# EAGLE design vca (EAGLE 9.5.2)
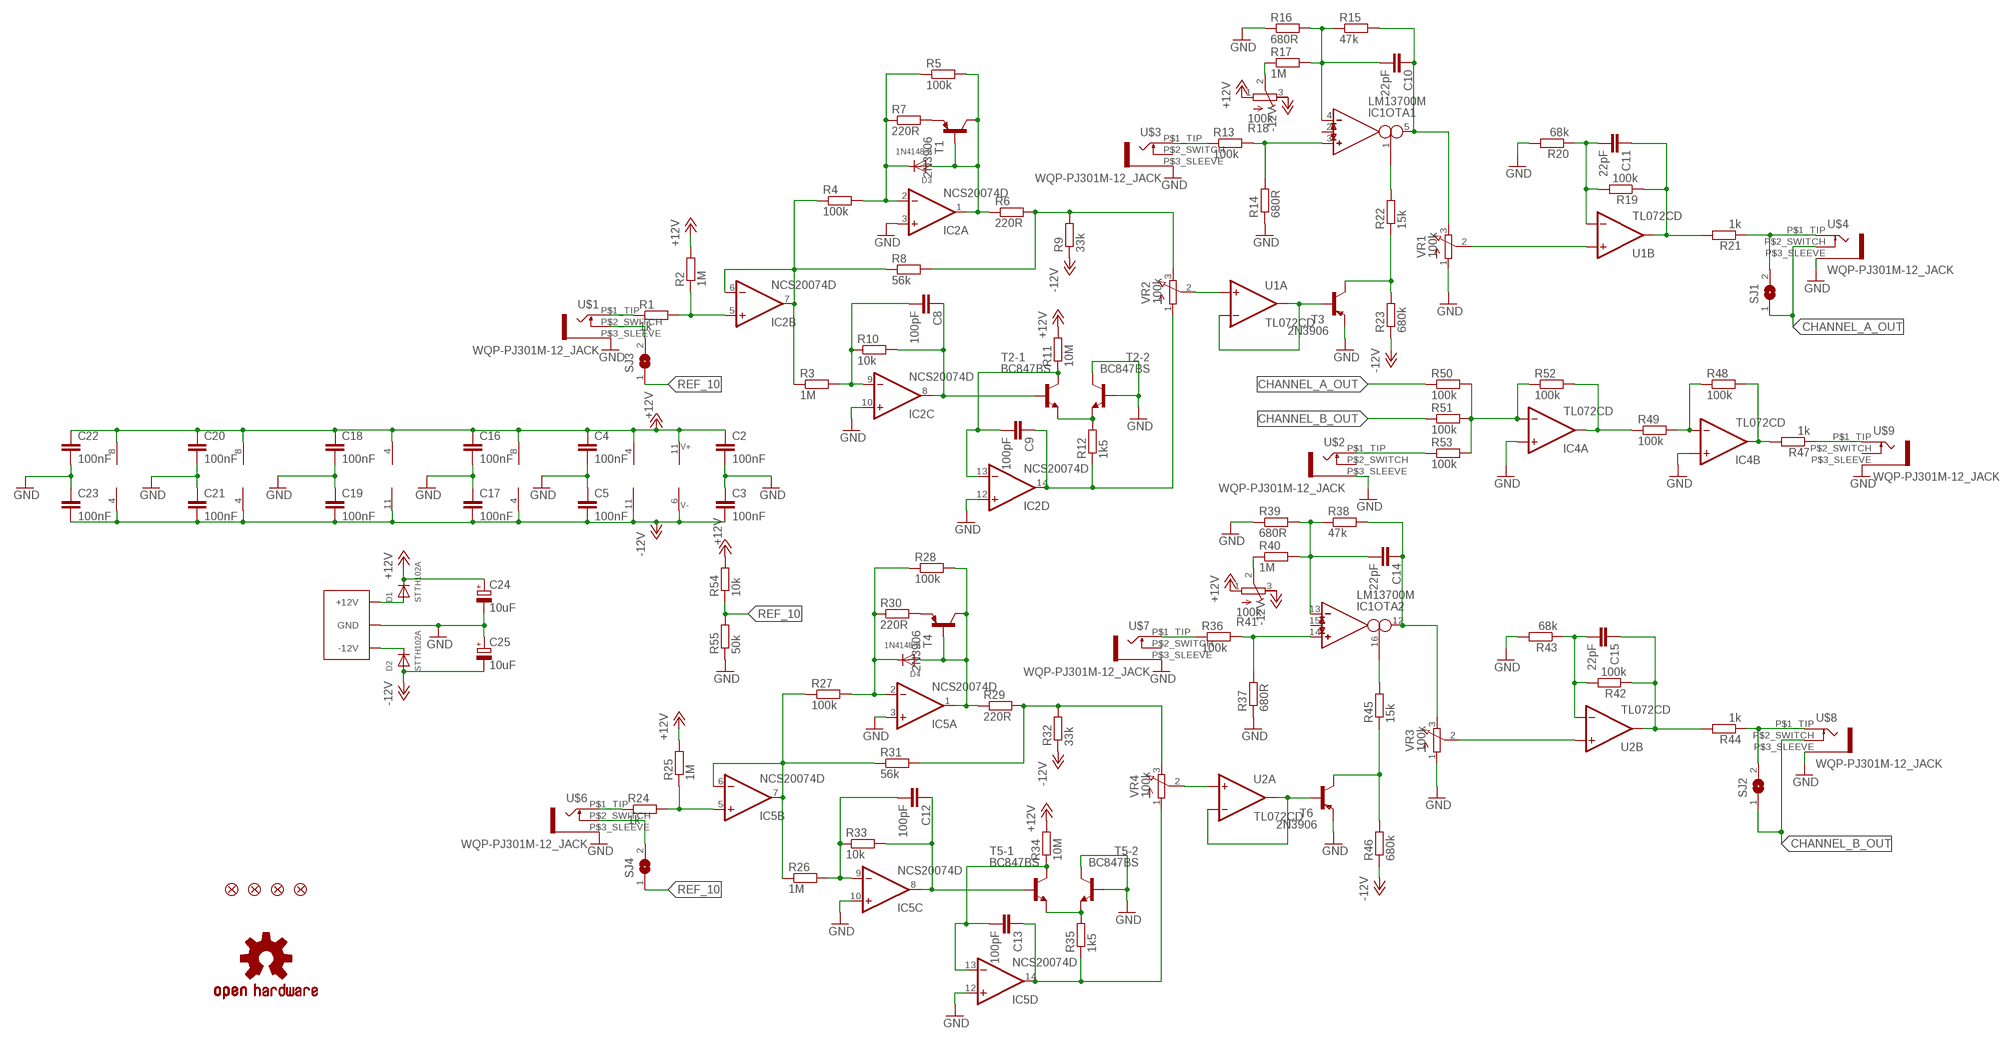
[diagram p0: schematic, sheet 1]

## Parts
C1  EURO_POWER_LOCKFAT-LOCK  [EURO_PWR_HEADER_LOCK]
C2  100nF  C-EUC0402  [C0402]
C3  100nF  C-EUC0402  [C0402]
C4  100nF  C-EUC0402  [C0402]
C5  100nF  C-EUC0402  [C0402]
C8  100pF  C-EUC0402  [C0402]
C9  100pF  C-EUC0402  [C0402]
C10  22pF  C-EUC0402  [C0402]
C11  22pF  C-EUC0402  [C0402]
C12  100pF  C-EUC0402  [C0402]
C13  100pF  C-EUC0402  [C0402]
C14  22pF  C-EUC0402  [C0402]
C15  22pF  C-EUC0402  [C0402]
C16  100nF  C-EUC0402  [C0402]
C17  100nF  C-EUC0402  [C0402]
C18  100nF  C-EUC0402  [C0402]
C19  100nF  C-EUC0402  [C0402]
C20  100nF  C-EUC0402  [C0402]
C21  100nF  C-EUC0402  [C0402]
C22  100nF  C-EUC0402  [C0402]
C23  100nF  C-EUC0402  [C0402]
C24  10uF  CPOL-EUA/3216-18W  [A/3216-18W]
C25  10uF  CPOL-EUA/3216-18W  [A/3216-18W]
D1  STTH102A  DIODESMA  [SMADIODE]
D2  STTH102A  DIODESMA  [SMADIODE]
D3  1N4148-2  DIODESOD-123  [SOD-123]
D4  1N4148-2  DIODESOD-123  [SOD-123]
FD1  FIDUCIAL1X2  [FIDUCIAL-1X2]
FD2  FIDUCIAL1X2  [FIDUCIAL-1X2]
FD3  FIDUCIAL1X2  [FIDUCIAL-1X2]
FD4  FIDUCIAL1X2  [FIDUCIAL-1X2]
IC1  LM13700M  [SO16]
IC2  NCS20074D  [SO14]
IC4  TL072CD  [SOIC8]
IC5  NCS20074D  [SO14]
LOGO1  OSHW-LOGOM  [OSHW-LOGO-M]
R1  1k  R-EU_R0402  [R0402]
R2  1M  R-EU_R0402  [R0402]
R3  1M  R-EU_R0402  [R0402]
R4  100k  R-EU_R0402  [R0402]
R5  100k  R-EU_R0402  [R0402]
R6  220R  R-EU_R0402  [R0402]
R7  220R  R-EU_R0402  [R0402]
R8  56k  R-EU_R0402  [R0402]
R9  33k  R-EU_R0402  [R0402]
R10  10k  R-EU_R0402  [R0402]
R11  10M  R-EU_R0402  [R0402]
R12  1k5  R-EU_R0402  [R0402]
R13  100k  R-EU_R0402  [R0402]
R14  680R  R-EU_R0402  [R0402]
R15  47k  R-EU_R0402  [R0402]
R16  680R  R-EU_R0402  [R0402]
R17  1M  R-EU_R0402  [R0402]
R18  100k  R-TRIMM64W  [RTRIM64W]
R19  100k  R-EU_R0402  [R0402]
R20  68k  R-EU_R0402  [R0402]
R21  1k  R-EU_R0402  [R0402]
R22  15k  R-EU_R0402  [R0402]
R23  680k  R-EU_R0402  [R0402]
R24  1k  R-EU_R0402  [R0402]
R25  1M  R-EU_R0402  [R0402]
R26  1M  R-EU_R0402  [R0402]
R27  100k  R-EU_R0402  [R0402]
R28  100k  R-EU_R0402  [R0402]
R29  220R  R-EU_R0402  [R0402]
R30  220R  R-EU_R0402  [R0402]
R31  56k  R-EU_R0402  [R0402]
R32  33k  R-EU_R0402  [R0402]
R33  10k  R-EU_R0402  [R0402]
R34  10M  R-EU_R0402  [R0402]
R35  1k5  R-EU_R0402  [R0402]
R36  100k  R-EU_R0402  [R0402]
R37  680R  R-EU_R0402  [R0402]
R38  47k  R-EU_R0402  [R0402]
R39  680R  R-EU_R0402  [R0402]
R40  1M  R-EU_R0402  [R0402]
R41  100k  R-TRIMM64W  [RTRIM64W]
R42  100k  R-EU_R0402  [R0402]
R43  68k  R-EU_R0402  [R0402]
R44  1k  R-EU_R0402  [R0402]
R45  15k  R-EU_R0402  [R0402]
R46  680k  R-EU_R0402  [R0402]
R47  1k  R-EU_R0402  [R0402]
R48  100k  R-EU_R0402  [R0402]
R49  100k  R-EU_R0402  [R0402]
R50  100k  R-EU_R0402  [R0402]
R51  100k  R-EU_R0402  [R0402]
R52  100k  R-EU_R0402  [R0402]
R53  100k  R-EU_R0402  [R0402]
R54  10k  R-EU_R0402  [R0402]
R55  50k  R-EU_R0402  [R0402]
SJ1  SJ  [SJ]
SJ2  SJ  [SJ]
SJ3  SJ  [SJ]
SJ4  SJ  [SJ]
T1  2N3906  MMBT3906LT1-PNP-SOT23-BEC  [SOT23-BEC]
T2  BC847BS  [SOT363]
T3  2N3906  MMBT3906LT1-PNP-SOT23-BEC  [SOT23-BEC]
T4  2N3906  MMBT3906LT1-PNP-SOT23-BEC  [SOT23-BEC]
T5  BC847BS  [SOT363]
T6  2N3906  MMBT3906LT1-PNP-SOT23-BEC  [SOT23-BEC]
U1  TL072CD  [SOIC8]
U2  TL072CD  [SOIC8]
U$1  WQP-PJ301M-12_JACK  [WQP-PJ301M-12_JACK]
U$2  WQP-PJ301M-12_JACK  [WQP-PJ301M-12_JACK]
U$3  WQP-PJ301M-12_JACK  [WQP-PJ301M-12_JACK]
U$4  WQP-PJ301M-12_JACK  [WQP-PJ301M-12_JACK]
U$6  WQP-PJ301M-12_JACK  [WQP-PJ301M-12_JACK]
U$7  WQP-PJ301M-12_JACK  [WQP-PJ301M-12_JACK]
U$8  WQP-PJ301M-12_JACK  [WQP-PJ301M-12_JACK]
U$9  WQP-PJ301M-12_JACK  [WQP-PJ301M-12_JACK]
VR1  100k  9MM_SNAP-IN_POT_  [9MM_SNAP-IN_POT]
VR2  100k  9MM_SNAP-IN_POT_  [9MM_SNAP-IN_POT]
VR3  100k  9MM_SNAP-IN_POT_  [9MM_SNAP-IN_POT]
VR4  100k  9MM_SNAP-IN_POT_  [9MM_SNAP-IN_POT]

## Nets
+12V [power]: C2.1 C4.1 C16.1 C18.1 C20.1 C22.1 C24.+ D1.C IC1.11(SUPPLY:V+) IC2.4(P:V+) IC4.8(P:V+) IC5.4(P:V+) R2.2 R11.2 R18.1(A) R25.2 R34.2 R41.1(A) R54.2 U1.8(P:V+) U2.8(P:V+)
-12V [power]: C3.2 C5.2 C17.2 C19.2 C21.2 C23.2 C25.- D2.A IC1.6(SUPPLY:V-) IC2.11(P:V-) IC4.4(P:V-) IC5.11(P:V-) R9.1 R18.3(E) R23.1 R32.1 R41.3(E) R46.1 U1.4(P:V-) U2.4(P:V-)
CHANNEL_A: R21.1 SJ1.2 U$4.P$1_TIP
CHANNEL_A_OUT: R50.1 SJ1.1 U$4.P$2_SWITCH
CHANNEL_B: R44.1 SJ2.2 U$8.P$1_TIP
CHANNEL_B_OUT: R51.1 SJ2.1 U$8.P$2_SWITCH
GND [power]: C1.GND1(GND) C1.GND2(GND) C1.GND3(GND) C1.GND4(GND) C1.GND5(GND) C1.GND6(GND) C2.2 C3.1 C4.2 C5.1 C16.2 C17.1 C18.2 C19.1 C20.2 C21.1 C22.2 C23.1 C24.- C25.+ IC2.3(A:+IN) IC2.10(C:+IN) IC2.12(D:+IN) IC4.3(A:+IN) IC4.5(B:+IN) IC5.3(A:+IN) IC5.10(C:+IN) IC5.12(D:+IN) R14.1 R16.1 R20.2 R37.1 R39.1 R43.2 R55.1 T2.3(-2:C) T2.5(-2:B) T3.E T5.3(-2:C) T5.5(-2:B) T6.E U$1.P$3_SLEEVE U$2.P$3_SLEEVE U$3.P$3_SLEEVE U$4.P$3_SLEEVE U$6.P$3_SLEEVE U$7.P$3_SLEEVE U$8.P$3_SLEEVE U$9.P$3_SLEEVE VR1.1(A) VR3.1(A)
N$1: IC2.5(B:+IN) R1.2 R2.1
N$2: C8.2 IC2.9(C:-IN) R3.2 R10.1
N$3: IC2.6(B:-IN) IC2.7(B:OUT) R3.1 R4.1 R8.1
N$4: R1.1 U$1.P$1_TIP
N$5: C8.1 IC2.8(C:OUT) R10.2 T2.2(-1:B)
N$6: C9.2 IC2.13(D:-IN) R11.1 T2.6(-1:C)
N$7: R6.2 R8.2 R9.2 VR2.3(E)
N$8: R7.2 T1.E
N$9: D3.A IC2.1(A:OUT) R5.2 R6.1 T1.B T1.C
N$10: C10.2 IC1.4(OTA1:IN_N) R15.1 R16.2 R17.2
N$11: D3.C IC2.2(A:-IN) R4.2 R5.1 R7.1
N$12: R12.2 T2.1(-1:E) T2.4(-2:E)
N$13: C9.1 IC2.14(D:OUT) R12.1 VR2.1(A)
N$14: R13.1 U$3.P$1_TIP
N$15: IC1.3(OTA1:IN_P) R13.2 R14.2
N$16: R47.1 U$9.P$1_TIP
N$17: C10.1 IC1.5(OTA1:OUT) R15.2 VR1.3(E)
N$18: R17.1 R18.2(S)
N$19: U1.5(B:+IN) VR1.2(S)
N$20: C11.2 R19.2 R20.1 U1.6(B:-IN)
N$21: IC5.5(B:+IN) R24.2 R25.1
N$22: C11.1 R19.1 R21.2 U1.7(B:OUT)
N$23: T3.B U1.1(A:OUT) U1.2(A:-IN)
N$24: U1.3(A:+IN) VR2.2(S)
N$25: IC1.1(OTA1:I_BIAS) R22.2
N$26: R22.1 R23.2 T3.C
N$27: C12.2 IC5.9(C:-IN) R26.2 R33.1
N$28: IC5.6(B:-IN) IC5.7(B:OUT) R26.1 R27.1 R31.1
N$29: R24.1 U$6.P$1_TIP
N$30: R29.2 R31.2 R32.2 VR4.3(E)
N$31: R30.2 T4.E
N$32: D4.A IC5.1(A:OUT) R28.2 R29.1 T4.B T4.C
N$33: D4.C IC5.2(A:-IN) R27.2 R28.1 R30.1
N$34: C12.1 IC5.8(C:OUT) R33.2 T5.2(-1:B)
N$35: R35.2 T5.1(-1:E) T5.4(-2:E)
N$36: C13.2 IC5.13(D:-IN) R34.1 T5.6(-1:C)
N$37: C13.1 IC5.14(D:OUT) R35.1 VR4.1(A)
N$38: R36.1 U$7.P$1_TIP
N$39: IC1.14(OTA2:IN_P) R36.2 R37.2
N$40: C14.2 IC1.13(OTA2:IN_N) R38.1 R39.2 R40.2
N$41 [power]: C1.NEG1(-12V) C1.NEG2(-12V) D2.C
N$42 [power]: C1.POS1(+12V) C1.POS2(+12V) D1.A
N$43: C14.1 IC1.12(OTA2:OUT) R38.2 VR3.3(E)
N$44: R40.1 R41.2(S)
N$45: C15.2 R42.2 R43.1 U2.6(B:-IN)
N$46: U2.5(B:+IN) VR3.2(S)
N$47: C15.1 R42.1 R44.2 U2.7(B:OUT)
N$48: IC4.6(B:-IN) R48.1 R49.2
N$49: T6.B U2.1(A:OUT) U2.2(A:-IN)
N$50: U2.3(A:+IN) VR4.2(S)
N$51: IC1.16(OTA2:I_BIAS) R45.2
N$52: R45.1 R46.2 T6.C
N$53: IC4.1(A:OUT) R49.1 R52.2
N$54: IC4.7(B:OUT) R47.2 R48.2
N$55: IC4.2(A:-IN) R50.2 R51.2 R52.1 R53.2
N$56: SJ3.2 U$1.P$2_SWITCH
N$57: R53.1 U$2.P$1_TIP
N$58: SJ4.2 U$6.P$2_SWITCH
REF_10: R54.1 R55.2 SJ3.1 SJ4.1
Unconnected: IC1.2(OTA1:I_DIODE) IC1.7(BUF1:B) IC1.8(BUF1:E) IC1.9(BUF2:E) IC1.10(BUF2:B) IC1.15(OTA2:I_DIODE) U$2.P$2_SWITCH U$3.P$2_SWITCH U$7.P$2_SWITCH U$9.P$2_SWITCH

## Library data of the parts
C1 = jhbruhn-physical:EURO_POWER_LOCK
C2-C5 C8-C23 = jhbruhn-cr:C-EU: CAPACITOR, European symbol; SPICEPREFIX: C
C24 C25 = rcl:CPOL-EU: POLARIZED CAPACITOR, European symbol; SPICEPREFIX: C
D1-D4 = adafruit:DIODE: Diode SMADIODE - SMA Surface Mount Package 20V 1A Schottky Diode Digikey: 641-1014-6-ND DO-1N4148 - Through Hole Small Current Diode SOD-123 20V 1 A (.5mV Vf) Schottky Diode - Digikey: MBRX120TPMSCT-ND SOD-323 10V 570mA (.38mV Vf, 3ns) Schottky Diode - Digikey: ZLLS410CT-ND SOD-523 30V 30mA Schottky Diode (RB751S-40TE61) - Digikey: RB751S-40TE61CT-ND SOT23-R/W - SOT23 Package (R = Solder Paste/Reflow Ovens, W = Hand-Soldering) BAT54Film 40V 300mA - Digikey: 497-7162-1-ND
FD1-FD4 = SparkFun-Aesthetics:FIDUCIAL: Fiducial Alignment Points Point-of-reference for pick-and-place machines and other optical instruments.
IC1 = jhbruhn-ota:LM13700: Dual OTA with buffers
IC2 IC5 = ncs20074:NCS20074: OP AMP
IC4 U1 U2 = jhbruhn-opamp:TL072: Generic Dual Op Amp
LOGO1 = SparkFun-Aesthetics:OSHW-LOGO: Open-Source Hardware (OSHW) Logo This logo indicates the piece of hardware it is found on incorporates a OSHW license and/or adheres to the definition of open source hardware found here: http://freedomdefined.org/OSHW
R1-R17 R19-R40 R42-R55 = jhbruhn-cr:R-EU_: RESISTOR, European symbol; SPICEPREFIX: R
R18 R41 = rcl:R-TRIMM: Trimm resistor; SPICEMODEL: X; SPICEPREFIXL: POT
SJ1-SJ4 = jumper:SJ: SMD solder JUMPER
T1 T3 T4 T6 = transistor-neu-to92:*-PNP-: PNP Transistror
T2 T5 = nxp_60:BC847BS: NPN/NPN general-purpose transistor pair in a very small SOT363 (SC-88) Surface-Mounted Device (SMD) plastic package. AAL Eindhoven MK
U$1-U$4 U$6-U$9 = jhbruhn-physical:WQP-PJ301M-12_JACK
VR1-VR4 = jhbruhn-physical:9MM_SNAP-IN_POT: 9mm vertical snap-in pot, Alpha / Panasonic style

## Net classes
0 default: width 0.254 mm
1 power: width 0.406 mm

## Board
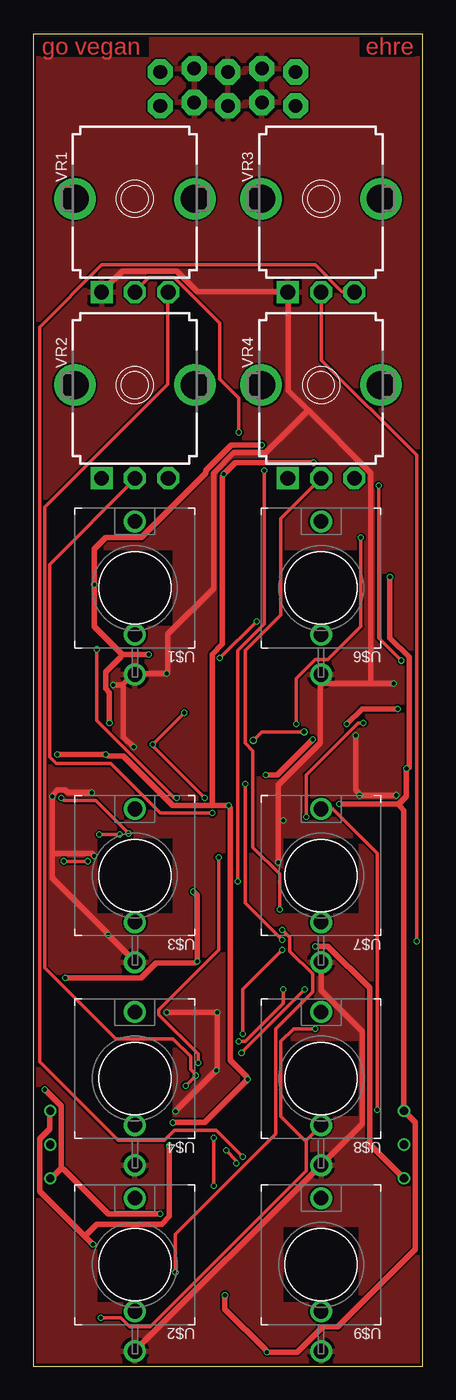
[diagram p1: board, top side]
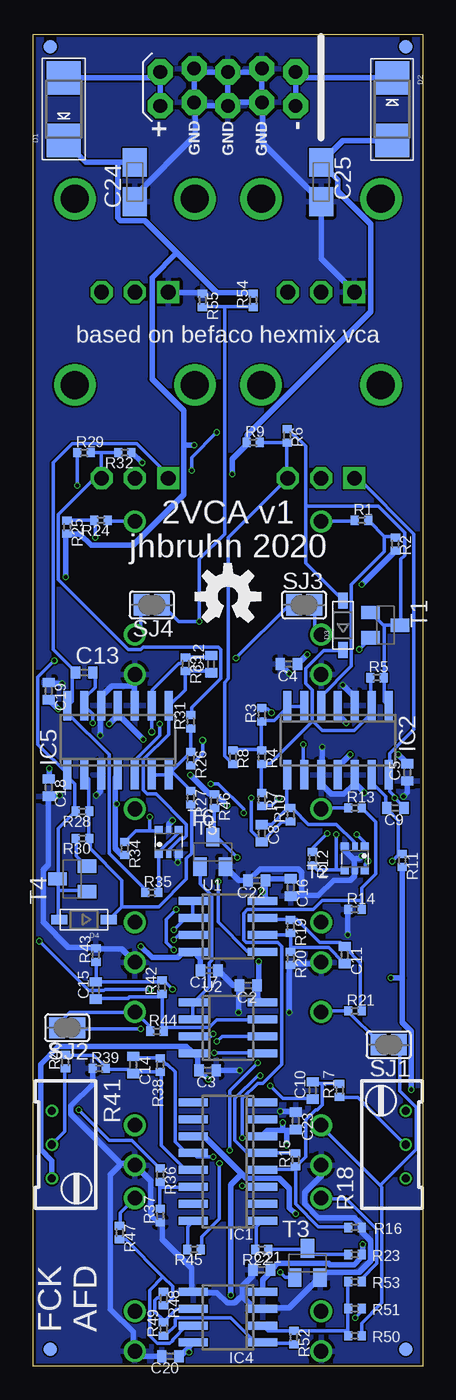
[diagram p2: board, bottom side, seen from below]

Size 29.21 x 100 mm. Coordinates in mm from the lower left corner, seen from the top.
Outline: 0,0 29.21,0 29.21,100 0,100 0,0
Copper layers (1*16): Top 0.035559375mm / dielectric 1.6mm / Bottom 0.035559375mm
Design rules "jlcpcb2layer": minimum track width 5mil, minimum drill 12mil, track to track 5mil, track to pad 5mil, pad to pad 5mil, via to via 5mil, smd to smd 5mil, copper to edge 8mil, drill to drill 6mil, minimum pad ring 5mil, minimum via ring 3mil, stop-mask expansion 2.5mil, vias tented up to drill 0mil, thermal gap 10mil

### Footprints (pad centres in the part's own frame; a part is rotated, then mirrored left to right if it is on the bottom)
EURO_PWR_HEADER_LOCK = drill 1.016 pad 1.88 octagon: GND1 -2.54,1.143; GND2 -2.54,-1.397; GND3 0,1.397; GND4 0,-1.143; GND5 2.54,1.143; GND6 2.54,-1.397; NEG1 -5.08,1.397; NEG2 -5.08,-1.143; POS1 5.08,1.397; POS2 5.08,-1.143
C0402 = smd 0.7 x 0.9: 1 -0.65,0; 2 0.65,0
A/3216-18W = smd 2.15 x 1.8: + 1.475,0; - -1.475,0
SMADIODE = smd 2.54 x 2.54: A 2.349,0; C -2.349,0
SOD-123 = smd 1.2 x 0.7: A 1.85,0; C -1.85,0
FIDUCIAL-1X2 = smd 1 x 1: 1 0,0
SO16 = smd 0.6 x 2.2: 1 -4.445,-2.6; 2 -3.175,-2.6; 3 -1.905,-2.6; 4 -0.635,-2.6; 5 0.635,-2.6; 6 1.905,-2.6; 7 3.175,-2.6; 8 4.445,-2.6; 9 4.445,2.6; 10 3.175,2.6; 11 1.905,2.6; 12 0.635,2.6; 13 -0.635,2.6; 14 -1.905,2.6; 15 -3.175,2.6; 16 -4.445,2.6
SO14 = smd 0.6 x 2.2: 1 -3.81,-2.6; 2 -2.54,-2.6; 3 -1.27,-2.6; 4 0,-2.6; 5 1.27,-2.6; 6 2.54,-2.6; 7 3.81,-2.6; 8 3.81,2.6; 9 2.54,2.6; 10 1.27,2.6; 11 0,2.6; 12 -1.27,2.6; 13 -2.54,2.6; 14 -3.81,2.6
SOIC8 = smd 0.6 x 2.2: 1 -1.905,-2.6; 2 -0.635,-2.6; 3 0.635,-2.6; 4 1.905,-2.6; 5 1.905,2.6; 6 0.635,2.6; 7 -0.635,2.6; 8 -1.905,2.6
R0402 = smd 0.6 x 0.7: 1 -0.5,0; 2 0.5,0
RTRIM64W = drill 0.61: 1 1.27,-2.54; 2 1.27,0; 3 1.27,2.54
SJ = smd 1.168 x 1.6: 1 -0.762,0; 2 0.762,0
SOT23-BEC = smd 1 x 1.4: B -0.95,-1.1; C 0,1.1; E 0.95,-1.1
SOT363 = smd 0.6 x 0.6: 1 -0.75,-0.9; 3 0.75,-0.9; 4 0.75,0.9; 6 -0.75,0.9 | smd 0.4 x 0.6: 2 0,-0.9; 5 0,0.9
WQP-PJ301M-12_JACK = drill 1.1: P$1_TIP 0,5; P$2_SWITCH 0,-3.5; P$3_SLEEVE 0,-6.5
9MM_SNAP-IN_POT = drill 1.1 square: 1 -2.5,-7 | drill 1.1 octagon: 2 0,-7; 3 2.5,-7 | drill 2.1 pad 2.794: CHASSIS1 -4.5,0; CHASSIS2 4.5,0

### Placement (x,y rotation side)
C1  14.61,96.01 180 bottom
C2  13.08,28.57 180 bottom
C3  16.13,22.23 180 bottom
C4  10.03,52.7 180 bottom
C5  1.14,44.58 90 bottom
C8  12.06,40.01 270 bottom
C9  2.03,41.91 180 bottom
C10  8.26,20.7 90 bottom
C11  5.84,30.86 270 bottom
C12  15.88,52.7 90 bottom
C13  25.4,52.07 0 bottom
C14  21.72,22.61 270 bottom
C15  24.51,28.19 90 bottom
C16  9.91,35.94 270 bottom
C17  16,29.72 180 bottom
C18  28.07,43.43 270 bottom
C19  28.07,50.67 270 bottom
C20  18.92,0.76 180 bottom
C21  12.06,7.24 0 bottom
C22  12.45,36.45 180 bottom
C23  9.53,18.41 270 bottom
C24  21.59,88.9 90 bottom
C25  7.62,88.9 270 bottom
D1  26.92,94.36 90 bottom
D2  2.29,94.36 270 bottom
D3  5.97,55.63 90 bottom
D4  25.4,33.53 180 bottom
FD1  1.27,99.06 0 bottom
FD2  27.94,99.06 0 bottom
FD3  1.27,1.27 0 bottom
FD4  27.94,1.27 0 bottom
IC1  14.61,15.37 90 bottom
IC2  6.35,46.99 180 bottom
IC4  14.61,3.68 90 bottom
IC5  22.86,46.99 0 bottom
LOGO1  14.61,57.78 0 bottom
R1  4.57,63.5 0 bottom
R2  2.03,61.72 270 bottom
R3  12.06,48.9 90 bottom
R4  12.06,45.72 270 bottom
R5  3.43,51.69 0 bottom
R6  10.16,69.85 270 bottom
R7  12.06,42.55 270 bottom
R8  14.22,45.72 270 bottom
R9  12.7,69.34 0 bottom
R10  9.91,41.4 90 bottom
R11  1.52,37.97 270 bottom
R12  8.26,38.1 270 bottom
R13  5.08,41.91 0 bottom
R14  5.08,34.29 0 bottom
R15  9.53,15.49 90 bottom
R16  5.08,10.41 180 bottom
R17  6.22,20.7 90 bottom
R18  2.54,16.64 0 bottom
R19  9.91,33.02 270 bottom
R20  9.91,30.61 270 bottom
R21  5.08,26.67 0 bottom
R22  12.06,8.76 180 bottom
R23  5.08,8.38 180 bottom
R24  24.13,63.5 180 bottom
R25  26.67,62.99 270 bottom
R26  17.4,45.59 270 bottom
R27  17.4,42.67 270 bottom
R28  25.53,41.66 180 bottom
R29  25.4,68.58 0 bottom
R30  25.53,39.62 180 bottom
R31  17.4,48.39 90 bottom
R32  22.35,68.58 180 bottom
R33  17.78,52.7 270 bottom
R34  22.35,38.86 270 bottom
R35  20.32,35.56 0 bottom
R36  19.68,14.35 270 bottom
R37  19.68,11.3 90 bottom
R38  19.68,22.61 90 bottom
R39  24.26,22.35 0 bottom
R40  26.8,22.86 90 bottom
R41  26.54,16.64 180 bottom
R42  19.56,28.45 90 bottom
R43  24.51,30.86 90 bottom
R44  19.94,25.15 0 bottom
R45  17.14,8.76 180 bottom
R46  15.62,42.42 270 bottom
R47  22.73,10.03 270 bottom
R48  19.43,5.08 270 bottom
R49  19.43,2.79 90 bottom
R50  5.08,2.29 180 bottom
R51  5.08,4.32 180 bottom
R52  9.65,2.16 270 bottom
R53  5.08,6.35 180 bottom
R54  12.7,80.01 90 bottom
R55  16.51,80.01 270 bottom
SJ1  2.54,24.13 180 bottom
SJ2  26.67,25.4 180 bottom
SJ3  8.89,57.15 0 bottom
SJ4  20.32,57.15 180 bottom
T1  2.79,55.63 270 bottom
T2  5.08,38.1 180 bottom
T3  8.64,7.75 0 bottom
T4  26.29,36.58 90 bottom
T5  19.05,39.37 0 bottom
T6  15.75,38.61 0 bottom
U1  14.61,33.02 270 bottom
U2  14.61,25.4 270 bottom
U$1  7.62,58.42 0 top
U$2  7.62,7.62 0 top
U$3  7.62,36.83 0 top
U$4  7.62,21.59 0 top
U$6  21.59,58.42 0 top
U$7  21.59,36.83 0 top
U$8  21.59,21.59 0 top
U$9  21.59,7.62 0 top
VR1  7.62,87.63 0 top
VR2  7.62,73.66 0 top
VR3  21.59,87.63 0 top
VR4  21.59,73.66 0 top

### Tracks (layer width: path | path; a pad name or v marks a point on that pad's centre or on a via)
+12V  (via drill 0.3)
  Top 0.406: 6.67,53.44 4.57,55.53 v4.57,58.67 4.57,61.34 5.43,62.2 8.1,62.2 12.95,67.06 12.95,67.25 14.86,69.15 v17.14,69.15 | v8.67,53.44 6.67,53.44 | v5.71,48.29 5.71,50.58 5.43,50.86 5.43,52.1 6.57,53.24 6.67,53.44 | v12,35.62 12.29,35.34 v12.29,30.39 12.1,30.29 9.24,30.29 8.1,29.15 v2.38,29.15 | v0.86,20.77 2.1,19.53 2.1,14.86 | 2.1,14.86 1.33,14.1 R18.1 | v9.53,11.43 5.62,11.43 2.29,14.76 2.1,14.86 | 27.43,42.2 28,42.77 v28,44.86 28.19,44.96 28.19,53.24 26.77,54.67 v26.77,59.24 | v22.95,42.2 27.43,42.2 | 27.43,42.2 27.53,42.01 27.81,41.72 R41.1 27.91,19.05 28.67,18.29 28.67,8.76 22.86,2.95 21.72,2.95 19.81,1.05 v17.53,1.05 17.43,1.24 14.38,4.29 v14.38,5.33
  Bottom 0.406: D1.C 25.29,90.38 22.86,90.38 | 22.86,90.38 C24.+ | v4.57,58.67 2.1,61.15 R2.2 | v8.67,53.44 9.34,52.77 C4.1 | v5.71,48.29 6.29,48.86 6.29,49.53 IC2.4 | 18.43,83.58 20.86,86.01 22.67,86.01 22.86,86.2 22.86,90.38 | 18.43,83.58 15.43,80.58 12.76,80.58 R54.2 | 17.91,69.15 17.91,71.72 20.29,74.11 20.29,81.72 18.43,83.58 | 17.91,69.15 17.91,65.44 21.72,61.63 24.86,61.63 25.72,62.48 R25.2 26.77,62.29 v26.77,59.24 | 17.91,69.15 v17.14,69.15 | U2.8 12.1,27.34 12.38,27.62 12.38,28.57 C2.1 12.29,28.77 v12.29,30.39 | 11.81,35.62 11.81,35.15 12,34.96 U1.8 | 11.81,35.62 11.81,36.39 C22.1 11.72,36.58 9.91,36.58 C16.1 | v12,35.62 11.81,35.62 | 1.52,29.15 1.52,25.81 0.86,25.15 v0.86,20.77 | 1.52,29.15 R11.2 | 13.57,14.43 13.24,14.1 10.76,14.1 10,13.34 10,11.91 v9.53,11.43 | 13.57,14.43 16.38,17.24 17.14,17.24 IC1.11 | 1.52,29.15 v2.38,29.15 | 17.67,1.29 17.24,1.71 IC4.8 | 17.67,1.29 18.19,0.76 C20.1 | 23.05,42.2 23.05,44.2 IC5.4 | 23.05,42.2 23.05,38.86 22.57,38.39 22.38,38.39 R34.2 | v28,44.86 28,44.1 C18.1 | v22.95,42.2 23.05,42.2 | v17.53,1.05 17.53,1.14 17.67,1.29 | 13.57,14.43 14.38,13.62 v14.38,5.33
-12V  (via drill 0.3)
  Top 0.406: v21.05,67.82 15.14,67.82 v14.29,66.96 14.19,66.77 14.19,54.2 13.43,53.44 13.43,42.1 | v1.81,45.91 v5.43,45.91 5.62,45.81 6.76,45.81 10.48,42.1 13.43,42.1 | v17.43,44.39 18.29,44.39 v20.95,47.05 | v27.34,49.34 24.67,49.34 v23.53,48.2 | 13.43,42.1 v14.67,42.1 14.76,41.91 14.76,22.95 16,21.72 v16.1,21.53 12.86,18.29 v10.48,18.29 | v4.48,9.14 3.86,9.76 | 3.86,9.76 0.48,13.14 0.48,17.05 1.24,17.81 1.24,19.14 R18.3 | v10.19,16.57 10.19,11.24 9.62,10.67 4.76,10.67 3.86,9.76 | v21.14,31.53 22.1,31.53 25.24,28.38 25.24,16.67 R41.3
  Bottom 0.406: D2.A 5.98,92.01 C25.- 7.53,90.2 6.38,89.06 6.38,88.2 3.9,85.72 3.9,79.15 13.14,69.91 13.14,69.34 R9.1 13.24,69.15 14.29,68.1 v14.29,66.96 | v21.05,67.82 21.81,68.58 R32.1 | v1.81,45.91 1.14,45.24 C5.2 | v5.43,45.91 6.29,45.05 6.29,44.48 IC2.11 | v17.43,44.39 16,42.96 15.62,42.96 R46.1 15.43,42.86 v14.67,42.1 | v20.95,47.05 22.86,48.96 IC5.11 22.95,48.77 v23.53,48.2 | v27.34,49.34 28,50.01 C19.2 | 10.48,17.72 11.62,17.72 12,17.34 IC1.6 | 10.48,17.72 10.19,17.72 | 10.19,17.72 9.53,17.72 C23.2 | v4.48,9.14 4.48,8.48 R23.1 4.67,8.38 4.67,8.1 5.14,7.62 6.95,7.62 7.05,7.71 10.86,7.71 11.34,7.24 C21.2 11.43,7.05 12,6.48 12,5.62 IC4.4 | v10.19,16.57 10.19,17.72 | C17.2 16.67,29.72 16.67,30.57 17.14,31.05 U1.4 17.34,30.96 18.1,30.96 18.38,30.67 20.29,30.67 v21.14,31.53 | R41.3 27.81,15.43 28.67,16.29 28.67,22.67 27.34,24 17.72,24 17.34,23.62 U2.4 17.14,23.43 16.86,23.15 16.86,22.29 C3.2 16.67,22.1 v16.1,21.53 | v10.48,18.29 10.48,17.72
CHANNEL_A
  Bottom 0.254: U$4.P$1_TIP 7.62,26.67 R21.1 5.52,26.57 3.33,24.38 3.33,24.19 SJ1.2
CHANNEL_A_OUT
  Bottom 0.254: 3.19,13.57 7.62,18 U$4.P$2_SWITCH | 3.19,13.57 3.05,13.43 3.05,4.76 4.57,3.24 R50.1 | 3.19,13.57 0.48,16.29 0.48,19.43 1.71,20.67 1.71,24.1 SJ1.1
CHANNEL_B
  Bottom 0.254: R44.1 20.48,25.15 20.48,25.53 21.53,26.57 U$8.P$1_TIP 21.72,26.57 26.48,26.57 27.43,25.62 SJ2.2
CHANNEL_B_OUT  (via drill 0.3)
  Top 0.254: v5.05,3.62 6.57,3.62 7.24,2.95 8.76,2.95 20.48,14.67 20.48,16.95 | 20.48,16.95 21.53,18 U$8.P$2_SWITCH | v21.14,25.34 19.53,25.34 18.57,24.38 18.57,18.76 20.38,16.95 20.48,16.95
  Bottom 0.254: v5.05,3.62 4.67,4 4.67,4.29 R51.1 | v21.14,25.34 25.91,25.34 SJ2.1
GND  (via drill 0.3)
  Top 0.406: v10.67,19.14 v13.72,22.19 13.81,22.38 v13.81,26.57 v10,26.57 | 6.67,51.15 v6,51.15 | 6.67,51.15 7.43,51.91 U$1.P$3_SLEEVE 7.62,52.01 v10,52.01 10.1,52.2 10.1,54.96 13.53,58.39 13.53,67.06 15.05,68.58 17.43,68.58 20.62,71.77 | U$3.P$3_SLEEVE 7.62,30.39 v5.62,32.38 5.52,32.58 1.43,36.67 1.43,38.48 | 1.43,38.48 v1.43,42.77 1.52,42.96 1.81,43.24 2.38,43.24 2.57,43.05 v4.38,43.05 | v7.53,46.48 6.76,47.24 6.76,50.96 6.67,51.15 | v4.57,38.29 4.38,38.48 1.43,38.48 | VR1.1 5.14,80.68 6.67,82.2 10.76,82.2 12.29,80.68 19.05,80.68 VR3.1 19.14,80.49 19.14,73.25 20.62,71.77 | 18.38,40.96 18.38,43.62 21.53,46.77 21.53,51.91 U$6.P$3_SLEEVE 21.72,51.24 25.34,51.24 | 18.38,40.96 v18.38,37.81 | v18.76,40.96 18.38,40.96 | 25.34,51.24 v27.05,51.24 | v27.24,42.86 v24.48,42.86 24.38,43.05 24.19,43.24 v24.19,47.34 | U$2.P$3_SLEEVE 7.62,1.14 21.53,15.05 U$8.P$3_SLEEVE 21.72,15.24 24.67,18.19 24.67,25.15 21.62,28.19 21.62,30.29 U$7.P$3_SLEEVE | 20.62,71.77 25.34,67.06 25.34,51.24
  Bottom 0.406: C1.GND4 12.32,97.16 C1.GND2 C1.GND1 | C1.GND4 16.89,97.16 C1.GND6 C1.GND5 | C1.GND4 C1.GND3 | C1.GND1 14.35,94.87 C1.GND3 | C1.GND5 16.89,94.61 C1.GND3 | C17.1 15.34,29.72 14.19,28.57 C2.2 13.81,28.38 v13.81,26.57 | v10.67,19.14 9.53,19.14 C23.1 | v13.72,22.19 15.43,22.19 C3.1 | T6.E 14.76,37.43 13.81,36.48 13.14,36.48 C22.2 12.95,36.58 12.19,37.34 9.34,37.34 9.05,37.05 9.05,35.34 | 5.14,38.01 5.14,37.24 T2.5 5.14,37.05 5.14,36.77 5.43,36.48 6.67,36.48 7.81,35.34 9.05,35.34 | 5.14,38.01 5.81,38.67 5.81,38.96 T2.3 | 9.05,35.34 9.91,35.34 C16.2 | v10,52.01 10.67,52.67 C4.2 | v6,51.15 5.14,50.29 5.14,49.62 IC2.3 | U$3.P$3_SLEEVE 7.62,30.29 7.71,30.19 9.91,30.19 R20.2 10,30 v10,26.57 | v5.62,32.38 5.62,34.29 R14.1 | C5.1 1.14,43.05 v1.43,42.77 | v4.38,43.05 4.95,43.62 IC2.12 5.14,44.39 5.14,43.72 5.91,42.96 6.86,42.96 7.62,43.72 IC2.10 7.53,44.58 v7.53,46.48 | v4.57,38.29 4.76,38.1 4.95,38.1 5.14,38.01 | C24.- 21.53,87.44 21.53,87.92 17.05,92.39 17.05,94.49 C1.GND5 | R55.1 16.57,80.58 19.05,80.58 VR3.1 | VR1.1 5.14,80.68 7.62,83.15 C25.+ 7.71,87.53 12,91.82 12,94.68 C1.GND1 | v18.38,37.81 18.38,38.39 T5.3 | T5.5 19.05,40.67 v18.76,40.96 | v27.05,51.24 28,51.24 C19.1 | 21.62,51.05 21.62,51.91 U$6.P$3_SLEEVE | 21.62,51.05 21.62,49.62 IC5.10 | 21.62,51.05 23.34,51.05 24.1,50.29 24.1,49.62 IC5.12 24.19,49.44 v24.19,47.34 | U$7.P$3_SLEEVE 21.62,30.39 22.57,31.34 24.48,31.34 R43.2 24.67,31.43 26.57,31.43 28.48,33.34 28.48,37.24 28.1,37.62 28.1,42.77 C18.2 27.91,42.86 v27.24,42.86 | v24.48,42.86 24.19,43.15 24.19,44.39 IC5.3 | 13.53,5.24 13.53,6 12.76,6.76 12.76,7.24 C21.1 | 13.53,5.24 12.67,4.38 12.1,4.38 IC4.3 11.81,4.38 10,4.38 7.81,6.57 T3.E 7.62,6.67 7.24,7.05 4.76,7.05 3.9,7.91 3.9,9.43 4.57,10.1 4.57,10.38 R16.1 4.57,10.57 5.14,11.14 7.81,11.14 8.86,12.19 8.86,13.05 7.62,14.29 U$4.P$3_SLEEVE
  Bottom 0.406: 13.53,5.24 13.72,5.14 14.1,4.76 14.67,4.76 15.43,5.52 17.14,5.52 IC4.5 17.34,5.71 17.34,7.33 19.53,9.53 19.53,10.67 R37.1 19.72,10.86 19.91,10.86 20.38,11.34 20.38,13.91 21.53,15.05 U$8.P$3_SLEEVE 21.72,15.24 22.67,15.24 | C20.2 21.24,0.76 21.53,1.05 U$9.P$3_SLEEVE 21.72,1.24 21.72,2.57 23.43,4.29 23.43,14.38 22.77,15.05 22.67,15.24 | 22.67,15.24 26.38,18.95 26.38,19.53 24.77,21.14 24.77,22.29 R39.1
  pour Bottom: 0,99.69 0,0 29.84,0 29.84,100.33 0,100.33
  pour Top: 0,100.33 0,0 29.84,0 29.84,100.33
N$1
  Bottom 0.254: 2.86,62.29 2.1,62.29 R2.1 | 2.86,62.29 4,63.44 R1.2 | 2.86,62.29 2.86,61.15 5.33,58.67 5.33,52.58 7.62,50.29 IC2.5
N$2  (via drill 0.3)
  Top 0.254: v11.34,49.05 v8.95,46.67 8.95,46.58 v12.86,42.67
  Bottom 0.254: R10.1 9.91,40.86 10.57,40.86 12,39.43 C8.2 12.1,39.43 12.86,40.2 v12.86,42.67 | v11.34,49.05 11.62,49.34 12,49.34 R3.2 | v8.95,46.67 8.95,44.48 IC2.9
N$3
  Bottom 0.254: R8.1 14.19,46.29 12.19,46.29 R4.1 12.1,46.29 12.1,48.39 R3.1 12,48.48 11.14,48.48 10.1,49.53 IC2.7 10,49.53 8.95,49.53 IC2.6
N$4
  Bottom 0.254: R1.1 5.14,63.44 7.62,63.44 U$1.P$1_TIP
N$5
  Bottom 0.254: T2.2 5.14,39.05 5.14,39.34 6.48,40.67 8.57,40.67 9.72,41.81 9.91,41.81 R10.2 | C8.1 12,40.67 11.34,40.67 10.19,41.81 10,41.81 R10.2 | IC2.8 10.19,44.39 10.19,41.91 R10.2
N$6  (via drill 0.3)
  Top 0.254: v2.29,37.91 v4.1,37.91
  Bottom 0.254: v4.1,37.91 4.29,37.72 4.29,37.24 T2.6 | v2.29,37.91 1.81,38.39 1.52,38.39 R11.1 1.81,38.48 1.81,40.96 2.67,41.81 C9.2 2.76,41.91 2.76,42.77 3.81,43.81 IC2.13
N$7
  Bottom 0.254: R9.2 10.19,69.34 R6.2 10.19,69.25 10.19,66.77 VR2.3 10.19,66.58 14.57,62.2 14.57,51.63 14.86,51.34 14.86,45.81 14.29,45.24 R8.2
N$8  (via drill 0.3)
  Top 0.254: v10.76,42.67 10.57,42.67 4.76,48.48 v4.76,53.82
  Bottom 0.254: v10.76,42.67 11.34,42.1 12,42.1 R7.2 | v4.76,53.82 3.9,54.67 T1.E
N$9
  Bottom 0.254: 2.86,55.63 2.95,55.63 3.81,56.48 T1.B | 2.86,55.63 T1.C 1.62,55.72 1.62,60.58 1.33,60.87 1.33,62.58 3.33,64.58 8.76,64.58 | IC2.1 2.57,49.62 2.86,49.91 2.86,51.63 R5.2 2.86,51.72 2.86,55.63 | 8.76,64.58 8.76,60.29 6,57.53 D3.A | 8.76,64.58 8.76,69.06 9.62,69.91 9.72,69.91 10.1,70.29 R6.1
N$10
  Bottom 0.254: 7.53,21.24 8.1,21.24 8.19,21.34 C10.2 | 7.53,21.24 6.29,21.24 R17.2 | R15.1 9.53,12.19 7.81,10.48 5.62,10.48 R16.2 | 7.53,21.24 7.53,19.62 7.91,19.24 8,19.24 8.76,18.48 8.76,15.72 9.43,15.05 R15.1 | IC1.4 12,14.76 9.62,14.76 R15.1
N$11
  Bottom 0.254: R5.1 3.9,51.63 3.9,49.72 3.81,49.62 IC2.2 3.9,49.53 3.9,48.96 5.14,47.72 7.53,47.72 8.19,48.39 8.29,48.39 | R7.1 12.1,43.05 12.1,45.15 R4.2 12,45.24 11.43,45.24 8.29,48.39 | 8.29,48.39 8.29,50.77 8.76,51.24 8.76,52.39 7.43,53.72 6,53.72 D3.C
N$12  (via drill 0.3)
  Top 0.254: v6.48,39.91 v4.95,39.91
  Bottom 0.254: 6.48,37.24 7.91,37.24 8.19,37.53 R12.2 | 6.48,37.24 5.91,37.24 T2.4 | v4.95,39.91 4.38,39.34 4.38,39.05 T2.1 | 6.48,37.24 v6.48,39.91
N$13  (via drill 0.3)
  Top 0.254: v7.14,40.01 4.67,42.48 2.29,42.48 v2.1,42.67
  Bottom 0.254: v7.14,40.01 8.19,38.96 8.19,38.67 R12.1 | C9.1 1.33,41.91 v2.1,42.67 2.1,42.77 2.48,43.15 2.48,44.39 IC2.14 2.48,44.48 2.48,46.01 0.67,47.82 0.67,62.48 4.76,66.58 5.05,66.58 VR2.1
N$14
  Bottom 0.254: R13.1 7.62,41.91 U$3.P$1_TIP
N$15  (via drill 0.3)
  Top 0.254: v13.53,17.14 v13.53,13.53
  Bottom 0.254: 4.57,34.96 4.57,35.91 3.52,36.96 3.52,40.86 R13.2 | 4.57,34.96 R14.2 | v13.53,13.53 12.1,13.53 IC1.3 | v13.53,17.14 13.53,20.1 12.38,21.24 12,21.24 10.57,22.67 10.57,31.53 10.86,31.81 13.24,31.81 13.43,32 13.43,34 13.14,34.29 8.19,34.29 7.53,34.96 4.57,34.96
N$16
  Bottom 0.254: R47.1 22.67,10.57 22.67,11.53 21.62,12.57 U$9.P$1_TIP
N$17  (via drill 0.3)
  Top 0.254: v11.43,21.05 v12.19,21.81 12.19,21.91 11.81,22.29 11.81,23.24 10.48,24.57 6.19,24.57 0.86,29.91 0.86,64.48 10.1,73.72 10.1,80.58 VR1.3
  Bottom 0.254: R15.2 9.53,16 IC1.5 13.14,16 14.1,16.95 14.1,20.1 12.38,21.81 v12.19,21.81 | v11.43,21.05 10.48,20.1 8.29,20.1 C10.1
N$18
  Bottom 0.254: R17.1 6.19,20.19 4.86,20.19 1.33,16.67 R18.2
N$19  (via drill 0.3)
  Top 0.254: v15.34,36.39 15.34,53.72 17.34,55.72 v17.34,67.25 | v15.43,70.1 15.43,72.68 14,74.11 14,78.3 10.57,81.72 8.67,81.72 7.62,80.68 VR1.2
  Bottom 0.254: v15.34,36.39 15.34,33.34 13.14,31.15 12.1,31.15 U1.5 | v17.34,67.25 17.34,68.2 v15.43,70.1
N$20
  Bottom 0.254: 9.91,31.43 R19.2 10,32.38 U1.6 | 9.91,31.43 R20.1 | 9.91,31.43 7.05,31.43 5.91,30.29 C11.2
N$21  (via drill 0.3)
  Top 0.254: v24.57,62.2 24.57,55.53 22.1,53.05 21.14,53.05 19.72,51.63 v19.72,48.2
  Bottom 0.254: R25.1 26.67,63.53 24.67,63.53 R24.2 24.57,63.44 v24.57,62.2 | v19.72,48.2 19.72,47.34 21.53,45.53 21.53,44.48 IC5.5
N$22
  Bottom 0.254: U1.7 12,33.62 11.91,33.53 R19.1 9.81,33.53 9.43,33.53 7.71,31.81 6.19,31.81 5.91,31.53 C11.1 5.81,31.43 4.67,30.29 4.67,26.67 R21.2
N$23  (via drill 0.3)
  Top 0.254: v10.67,7.05 10.67,9.91 18.19,17.43 18.19,25.34 20.95,28.1 20.95,29.43 19.24,31.15 19.24,32.19 v18.67,32.77
  Bottom 0.254: v10.67,7.05 10.29,6.67 9.62,6.67 T3.B | v18.67,32.77 17.81,33.62 17.24,33.62 U1.2 17.24,33.72 17.24,34.86 U1.1
N$24  (via drill 0.3)
  Top 0.254: v18.67,32 15.91,34.77 v15.91,43.72 | v13.43,41.53 9.53,41.53 5.81,45.24 1.71,45.24 1.24,45.72 1.24,60.2 7.62,66.58 VR2.2
  Bottom 0.254: U1.3 18.29,32.38 v18.67,32 | v15.91,43.72 15.34,43.72 13.43,41.81 v13.43,41.53
N$25
  Bottom 0.254: R22.2 12.48,8.76 12.48,10.48 12.1,10.86 IC1.1
N$26
  Bottom 0.254: R23.2 8.19,8.38 8.57,8.76 T3.C 8.67,8.76 R22.1
N$27  (via drill 0.35)
  Top 0.254: v16.51,46.99 17.14,47.62 v20.32,47.62
  Bottom 0.254: R26.2 16.95,45.54 16.94,45.54 16.51,45.97 v16.51,46.99 | v20.32,47.62 IC5.9 20.29,49.62 20.29,50.77 18.29,52.77 18.19,52.77 17.81,53.15 R33.1 17.72,53.24 16,53.24 15.91,53.34 C12.2
N$28
  Bottom 0.254: R31.1 R26.1 17.84,45.65 17.85,45.65 19.05,44.45 IC5.7 | IC5.7 IC5.6 | R27.1 17.43,43.24 18.76,44.58 IC5.7
N$29
  Bottom 0.254: R24.1 23.62,63.44 21.62,63.44 U$6.P$1_TIP
N$30
  Bottom 0.254: R29.2 24.1,68.58 | 24.1,68.58 R32.2 | R31.2 17.34,48.96 17.34,49.44 15.14,51.63 15.14,53.82 15.34,54.01 20.95,54.01 21.14,53.82 22.1,53.82 27.34,59.05 27.34,63.91 24.67,66.58 24.1,66.58 VR4.3 24.1,66.77 24.1,68.58
N$31
  Bottom 0.254: R30.2 26,39.62 26,38.29 25.24,37.53 T4.E
N$32  (via drill 0.3)
  Top 0.254: v25.91,66.1 25.91,54.67 v27.62,52.96
  Bottom 0.254: 27.34,35.72 27.34,36.58 T4.C 27.34,36.67 27.34,40.39 26.1,41.62 R28.2 26.1,41.72 26.1,43.72 26.67,44.29 IC5.1 26.67,44.48 28.86,46.67 28.86,51.72 v27.62,52.96 | 27.34,35.72 27.34,33.53 D4.A | 27.34,35.72 25.24,35.72 T4.B | v25.91,66.1 R29.1
N$33
  Bottom 0.254: IC5.2 25.34,44.39 25.05,44.1 25.05,41.72 R28.1 25.05,41.62 25.05,39.62 R30.1 24.96,39.53 24.96,38.86 22.57,36.48 22.57,34.48 | 22.57,34.48 19.81,34.48 17.72,36.58 17.72,38.1 17.34,38.48 17.34,42.1 R27.2 | 22.57,34.48 23.53,33.53 D4.C
N$34
  Bottom 0.254: C12.1 15.91,52.1 16,52.2 17.72,52.2 R33.2 17.81,52.1 17.81,50.77 18.95,49.62 IC5.8 19.05,47.43 20.95,45.53 20.95,43.24 20.67,42.96 20,42.96 17.72,40.67 17.72,39.81 17.91,39.62 18.19,39.62 19.05,38.77 T5.2
N$35
  Bottom 0.254: T5.4 18.38,40.2 18.38,40.01 19.72,38.67 19.72,38.48 T5.1 19.81,38.39 19.81,35.62 R35.2
N$36  (via drill 0.3)
  Top 0.254: v20.48,41.24 20.48,44.39 24.38,48.29 v24.77,48.29
  Bottom 0.254: 20.48,40.2 21.53,40.2 22.29,39.43 R34.1 | 20.48,40.2 19.81,40.2 T5.6 | C13.2 24.57,52.01 24.57,50.96 25.34,50.2 25.34,49.62 IC5.13 25.34,49.53 24.77,48.96 v24.77,48.29 | v20.48,41.24 20.48,40.2
N$37
  Bottom 0.254: R35.1 20.86,35.62 20.86,35.81 23.53,38.48 23.53,45.91 26.67,49.05 IC5.14 26.57,49.62 26.29,49.91 26.29,52.01 C13.1 26.29,52.1 26.29,52.39 27.72,53.82 27.72,67.82 26.29,69.25 21.43,69.25 19.14,66.96 19.14,66.67 VR4.1
N$38  (via drill 0.3)
  Top 0.254: v25.81,19.24 25.81,38.48 22.48,41.81 21.62,41.81 U$7.P$1_TIP
  Bottom 0.254: v25.81,19.24 23.53,16.95 21.81,16.95 19.72,14.86 R36.1
N$39
  Bottom 0.254: 19.72,13.43 19.72,13.81 R36.2 | 19.72,13.43 19.72,11.81 R37.2 | 19.72,13.43 17.24,13.43 IC1.14
N$40
  Bottom 0.254: R40.2 26.77,23.34 24.67,23.34 23.72,22.38 R39.2 23.72,22.29 22.1,22.29 21.81,22 C14.2 21.72,22 21.62,22.1 19.72,22.1 R38.1 19.62,22 19.62,16.57 17.81,14.76 17.24,14.76 IC1.13
N$41
  Bottom 0.406: D2.C 9.08,96.71 C1.NEG2 C1.NEG1
N$42
  Bottom 0.406: D1.A 20.13,96.71 C1.POS2 C1.POS1
N$43  (via drill 0.3)
  Top 0.254: v15.72,15.72 13.72,17.72 10.57,17.72 9.81,16.95 6.38,16.95 0.48,22.86 0.48,78.01 5.14,82.68 21.14,82.68 23.15,80.68 24,80.68 VR3.3
  Bottom 0.254: C14.1 21.72,23.24 21.62,23.15 19.72,23.15 R38.2 19.62,23.05 19.24,22.67 19.14,22.67 18.57,22.1 18.57,16.86 17.72,16 IC1.12 17.14,15.91 16.95,15.72 v15.72,15.72
N$44
  Bottom 0.254: R40.1 26.86,22.29 26.86,17.62 27.81,16.67 R41.2
N$45  (via drill 0.3)
  Top 0.254: v15.43,24.38 15.91,24.38 18.76,27.24 v18.76,28.29
  Bottom 0.254: R43.1 24.48,30.29 24.48,28.96 C15.2 24.48,28.86 19.62,28.86 R42.2 19.43,28.96 v18.76,28.29 | U2.6 15.05,24.77 v15.43,24.38
N$46  (via drill 0.3)
  Top 0.254: v20.38,28.29 v15.62,23.53 | v28.77,31.91 28.77,68.39 21.62,75.53 21.62,80.58 VR3.2
  Bottom 0.254: v15.62,23.53 12.1,23.53 U2.5 | v20.38,28.29 23.81,28.29 23.91,28.19 25.05,28.19 v28.77,31.91
N$47
  Bottom 0.254: C15.1 24.48,27.62 22.1,27.62 22,27.72 19.62,27.72 R42.1 19.53,27.91 19.53,25.15 R44.2 19.43,25.43 16,25.43 15.43,26 12.1,26 U2.7
N$48
  Bottom 0.254: IC4.6 17.24,4.29 18.48,4.29 19.43,3.33 R49.2 19.43,3.43 20.1,4.1 20.1,4.95 19.91,5.14 19.81,5.14 19.43,5.52 R48.1
N$49
  Bottom 0.254: T6.B 16.67,37.43 16.67,36.2 15.81,35.34 15.81,30.48 16,30.29 16,28.48 17.14,27.34 U2.1 17.24,27.24 17.24,26.1 U2.2
N$50  (via drill 0.3)
  Top 0.254: v15.72,24.96 15.72,28.29 v18.67,31.24 | v18.48,34.29 18.48,36.96 16.48,38.96 16.48,46.2 15.91,46.77 15.91,53.72 18.57,56.39 18.57,63.63 21.53,66.58 VR4.2
  Bottom 0.254: U2.3 15.91,24.77 v15.72,24.96 | v18.67,31.24 19.24,31.81 19.24,33.53 v18.48,34.29
N$51
  Bottom 0.254: R45.2 17.62,8.76 17.62,10.48 17.24,10.86 IC1.16
N$52  (via drill 0.3)
  Top 0.254: v15.24,15.24 15.24,15.43 v14.48,16.19 | v12.38,22.77 12.38,23.43 9.43,26.38 9.43,26.77 13.91,31.24 v13.91,38.2
  Bottom 0.254: R46.2 15.62,39.81 15.72,39.72 T6.C 15.53,39.81 v13.91,38.2 | v15.24,15.24 15.24,11.05 16.57,9.72 16.57,8.76 R45.1 | v14.48,16.19 14.48,20.67 v12.38,22.77
N$53
  Bottom 0.254: R52.2 9.72,1.71 12,1.71 IC4.1 12.1,1.81 12.57,1.81 14.38,3.62 18.48,3.62 18.57,3.52 18.57,3.05 19.24,2.38 19.43,2.38 R49.1
N$54
  Bottom 0.254: 19.48,6.71 22.29,9.53 22.67,9.53 R47.2 | 19.48,6.71 18.76,6 18.76,5.14 19.24,4.67 19.43,4.67 R48.2 | IC4.7 17.72,3.05 18.76,2 18.76,1.91 18.95,1.71 19.91,1.71 20.48,2.29 20.48,5.71 19.48,6.71
N$55
  Bottom 0.254: 5.62,2.67 5.62,4.29 R51.2 5.62,4.38 5.62,6.29 R53.2 | 5.62,2.67 5.62,2.29 R50.2 | IC4.2 11.62,2.67 9.72,2.67 R52.1 9.53,2.67 5.62,2.67
N$56
  Bottom 0.254: SJ3.2 8.1,57.15 8.1,55.44 7.62,54.96 U$1.P$2_SWITCH
N$57
  Bottom 0.254: R53.1 4.57,6.38 4.57,6.57 3.43,7.71 3.43,10.29 5.71,12.57 7.62,12.57 U$2.P$1_TIP
N$58
  Bottom 0.254: SJ4.2 21.14,57.15 21.14,55.34 21.53,54.96 U$6.P$2_SWITCH
REF_10  (via drill 0.3)
  Top 0.254: v16.76,55.91 v14,53.15
  Bottom 0.254: 14.86,79.53 16.48,79.53 R55.2 | 14.86,79.53 12.76,79.53 R54.1 | SJ3.1 10,57.15 v14,53.15 | SJ4.1 19.53,57.15 18.29,55.91 v16.76,55.91 16.76,60.58 14.86,62.48 14.86,79.53

### Text on the board
Top: go vegan | ehre
bNames: based on befaco hexmix vca | 2VCA v1 | jhbruhn 2020 | FCK / AFD